# EAGLE design Zio Qwiic Gesture Sensor PAJ7620U2 (EAGLE 9.2.2)
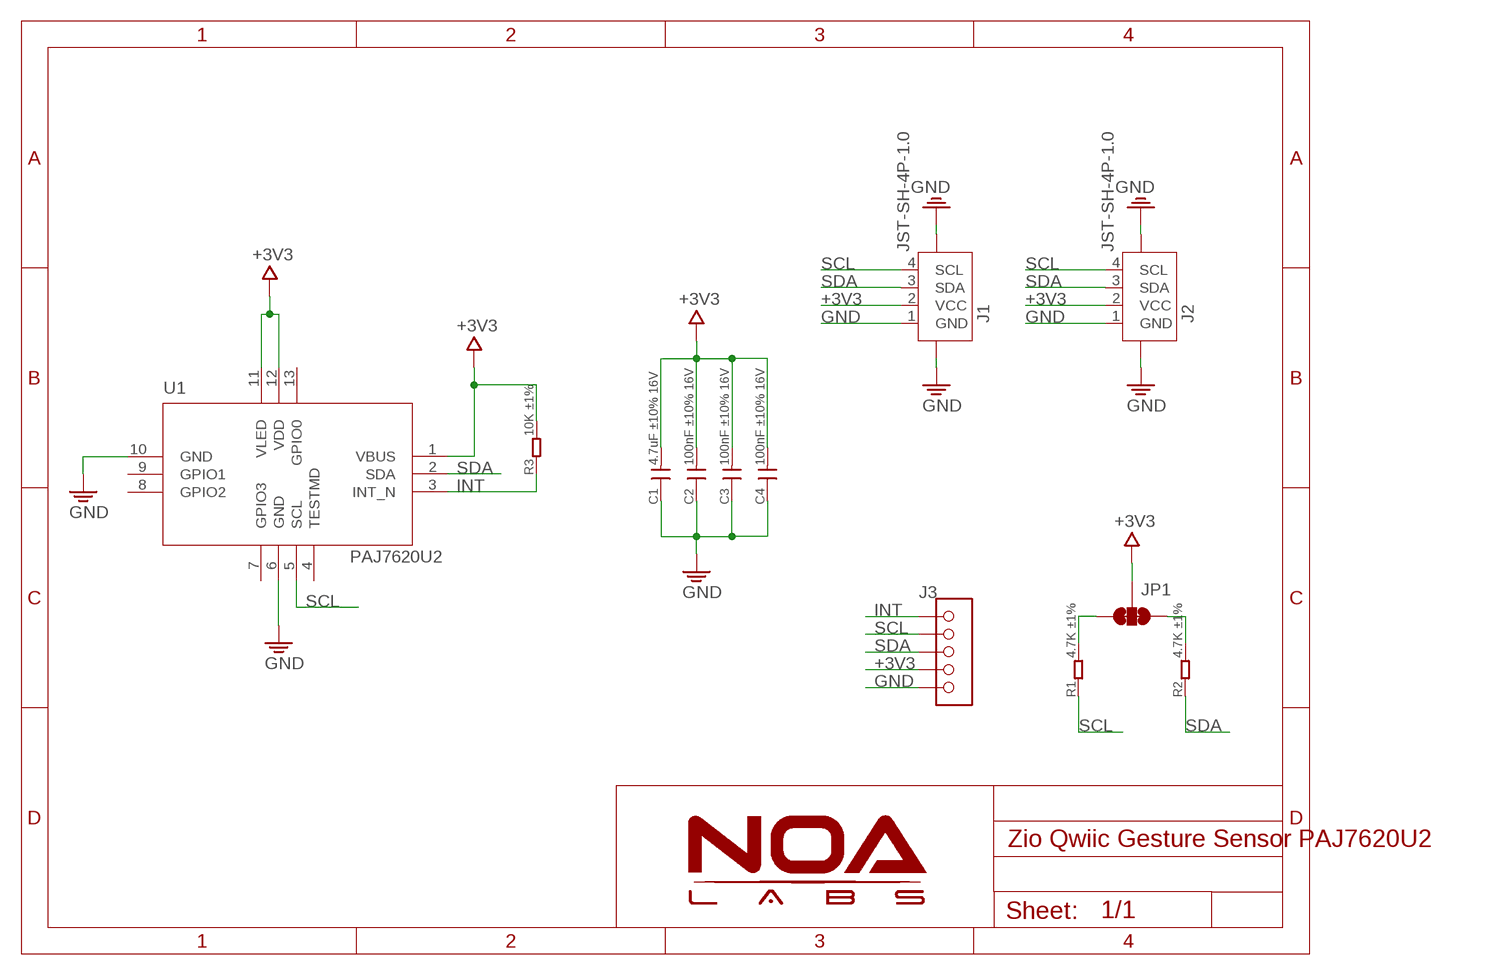
[diagram p0: schematic, sheet 1]

## Parts
C1  4.7uF ±10% 16V  C-0603  [C0603]
C2  100nF ±10% 16V  C-0603  [C0603]
C3  100nF ±10% 16V  C-0603  [C0603]
C4  100nF ±10% 16V  C-0603  [C0603]
J1  JST-SH-4P-1.0  [JST-SH-4P]
J2  JST-SH-4P-1.0  [JST-SH-4P]
J3  HEADER-5P-2.54  [5P-2.54]
JP1  SMT-JUMPER_3_2-NC_TRACE  [SMT-JUMPER_3_2-NC_TRACE]
R1  4.7K ±1%  R-0603  [R0603]
R2  4.7K ±1%  R-0603  [R0603]
R3  10K ±1%  R-0603  [R0603]
U1  PAJ7620U2  [PAJ7620U2]

## Nets
+3V3: C1.2 C2.2 C3.2 C4.2 J1.2(VCC) J2.2(VCC) J3.4 JP1.2 R3.2 U1.1(VBUS) U1.11(VLED) U1.12(VDD)
GND: C1.1 C2.1 C3.1 C4.1 J1.1(GND) J1.NC1 J1.NC2 J2.1(GND) J2.NC1 J2.NC2 J3.5 U1.6(GND) U1.10(GND)
INT: J3.1 R3.1 U1.3(INT_N)
N$6: JP1.3 R1.2
N$8: JP1.1 R2.2
SCL: J1.4(SCL) J2.4(SCL) J3.2 R1.1 U1.5(SCL)
SDA: J1.3(SDA) J2.3(SDA) J3.3 R2.1 U1.2(SDA)
Unconnected: U1.4(TESTMD) U1.7(GPIO3) U1.8(GPIO2) U1.9(GPIO1) U1.13(GPIO0)

## Library data of the parts
C1-C4 = RCL:C
J1 J2 = Connector:JST-SH-4P
J3 = Connector_NOA:HEADER-5P
JP1 = NOA-Jumpers:SMT-JUMPER_3_2-NC_TRACE
R1-R3 = RCL:R
U1 = IC:PAJ7620U2

## Board
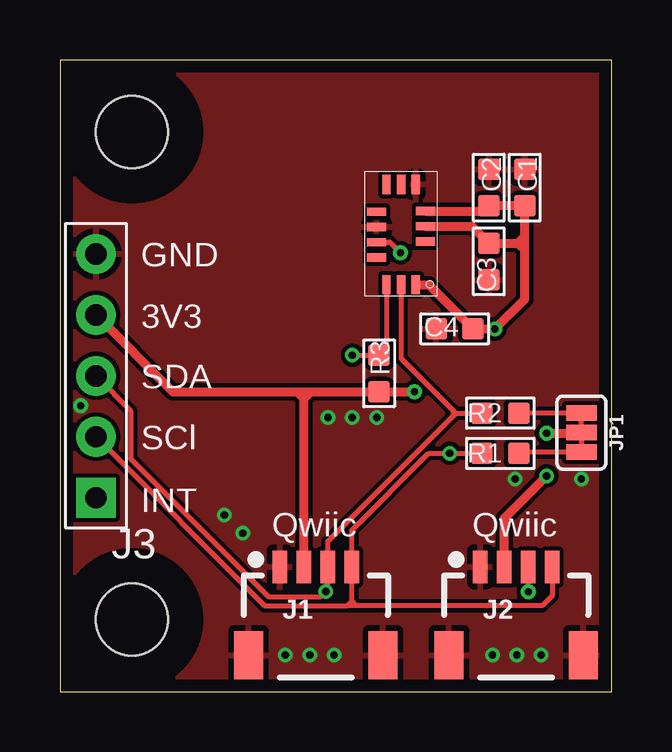
[diagram p1: board, top side]
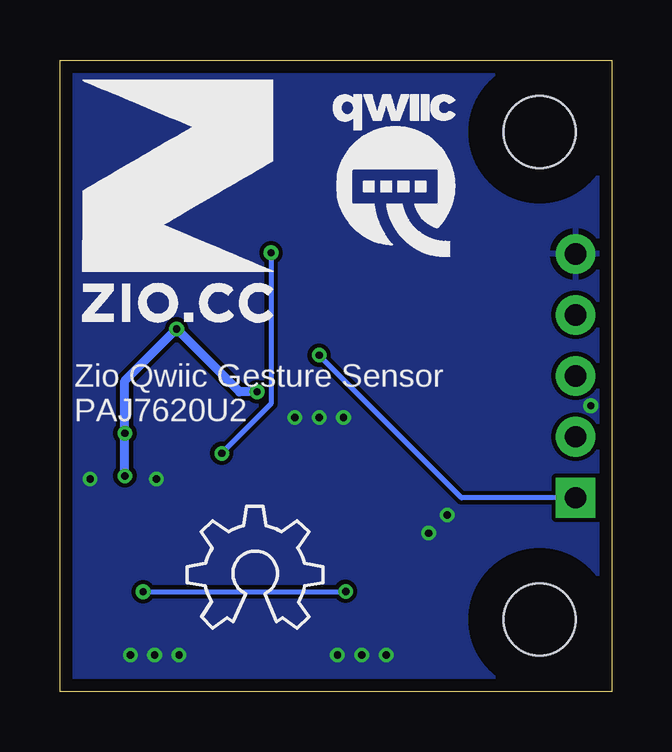
[diagram p2: board, bottom side, seen from below]

Size 23 x 26.32 mm. Coordinates in mm from the lower left corner, seen from the top.
Outline: 0,0 23,0 23,26.32 0,26.32 0,0
Copper layers (1*16): Top 0.035mm / dielectric 1.5mm / Bottom 0.035mm
Design rules "NOA Eagle Rule": minimum track width 7mil, minimum drill 12mil, track to track 7mil, track to pad 7mil, pad to pad 7mil, via to via 7mil, smd to smd 0mil, copper to edge 20mil, drill to drill 10mil, minimum pad ring 10mil, minimum via ring 6mil, stop-mask expansion 2mil, vias tented up to drill 25mil, thermal gap 10mil
Holes 3 mm at 3,3 3,23.32
tRestrict: area 0.1,0.1 to 5.9,5.9; area 0.1,20.4 to 5.9,26.2
bRestrict: area 0.1,0.1 to 5.9,5.9; area 0.1,20.4 to 5.9,26.2

### Footprints (pad centres in the part's own frame; a part is rotated, then mirrored left to right if it is on the bottom)
C0603 = smd 0.889 x 0.889: 1 -0.762,0; 2 0.762,0
JST-SH-4P = smd 0.6 x 1.35: 1 1.5,0; 2 0.5,0; 3 -0.5,0; 4 -1.5,0 | smd 1.2 x 2: NC1 -2.8,3.675; NC2 2.8,3.675
5P-2.54 = drill 0.889 pad 1.651 square: 1 0,5.08 | drill 0.889 pad 1.651: 2 0,2.54; 3 0,0; 4 0,-2.54; 5 0,-5.08
SMT-JUMPER_3_2-NC_TRACE = smd 0.635 x 1.27: 1 -0.813,0; 2 0,0; 3 0.813,0
R0603 = smd 0.889 x 0.889: 1 -0.762,0; 2 0.762,0
PAJ7620U2 = smd 0.8 x 0.35: 1 2.12,0.61; 2 2.12,0; 3 2.12,-0.61; 8 -2.06,-0.61; 9 -2.06,0; 10 -2.06,0.61 | smd 0.35 x 0.8: 4 0.983,-1.02; 5 0.348,-1.02; 6 -0.287,-1.02; 7 -0.922,-1.02; 11 -0.953,1.02; 12 -0.318,1.02; 13 0.318,1.02

### Placement (x,y rotation side)
C1  19.38,21.01 270 top
C2  17.88,21.01 270 top
C3  17.88,17.93 90 top
C4  16.46,15.11 0 top
J1  10.67,5.2 180 top
J2  19.02,5.2 180 top
J3  1.5,13.16 180 top
JP1  21.74,10.79 270 top
R1  18.36,9.93 0 top
R2  18.36,11.61 0 top
R3  13.31,13.26 270 top
U1  14.22,19.08 270 top
U$4  [10MM]  22.07,15.42 0 bottom
U$5  [QWIIC-LOGO-MEDIUM]  9.07,21.56 0 bottom
U$6  [OSHW_6X200_NOTEXT]  17.7,2.64 0 bottom

### Tracks (layer width: path | path; a pad name or v marks a point on that pad's centre or on a via)
+3V3  (via drill 0.3)
  Top 0.381: U1.11 17.67,20.03 C2.2 C1.2 19.38,18.97 | U1.12 17.18,19.39 C3.2 19.1,18.69 | U1.1 15.38,16.95 C4.2 v18.14,15.11 19.38,16.36 19.38,18.41 | 19.38,18.41 19.38,18.97 | 19.1,18.69 19.38,18.97 | 19.1,18.69 19.38,18.41 | J2.2 18.52,7.22 v20.3,8.99 | v20.3,10.77 21.72,10.77 JP1.2 | J3.4 4.7,12.5 9.88,12.5 | 9.88,12.5 10.46,12.5 | 10.46,12.5 R3.2 v14.78,12.5 | J1.2 10.17,12.2 | 10.17,12.2 10.46,12.5 | 10.17,12.2 10.17,12.21 9.88,12.5
  Bottom 0.381: v20.3,8.99 v20.3,10.77 20.3,12.95 v18.14,15.11 15.52,12.5 v14.78,12.5
GND  (via drill 0.3)
  other vias: 9.4,1.52 10.41,1.52 11.43,1.52 18.03,1.52 19.05,1.52 20.07,1.52 7.62,6.6 6.86,7.37 11.18,11.43 12.19,11.43 13.21,11.43 0.86,11.91 18.97,8.86 21.74,8.86
  pour Bottom: 0,26.31 22.99,26.31 22.99,0 0,0
  pour Top: 0,26.31 22.99,26.31 22.99,0 0,0
INT  (via drill 0.3)
  Top 0.203: U1.3 13.61,14.32 R3.1 v12.19,14.02
  Bottom 0.203: J3.1 6.25,8.08 v12.19,14.02
N$6
  Top 0.203: JP1.3 19.18,9.98 R1.2
N$8
  Top 0.203: JP1.1 R2.2
SCL  (via drill 0.3)
  Top 0.203: R1.1 v16.26,9.93 15.37,9.93 12.17,6.73 J1.4 12.17,3.76 | J3.2 8.54,3.58 11.99,3.58 | 11.99,3.58 12.17,3.76 | J2.4 20.52,3.99 20.12,3.58 12.35,3.58 | 12.35,3.58 11.99,3.58 | 12.17,3.76 12.35,3.58 | U1.5 13.76,18.73 v14.2,18.29
  Bottom 0.203: v14.2,18.29 14.2,11.99 v16.26,9.93
SDA  (via drill 0.3)
  Top 0.203: 16.5,11.61 R2.1 | 16.38,11.48 16.5,11.61 | J3.3 2.95,11.71 2.95,9.71 8.7,3.96 10.87,3.96 v11.09,4.18 11.17,4.26 J1.3 11.17,6.27 16.36,11.46 16.38,11.48 | J2.3 v19.52,4.17 v19.53,4.17 | U1.2 14.22,13.89 16.38,11.73 | 16.38,11.73 16.5,11.61 | 16.38,11.73 16.38,11.48
  Bottom 0.203: v19.53,4.17 11.1,4.17 v11.09,4.18

### Text on the board
tPlace: GND | 3V3 | SDA | SCl | INT | Qwiic | Qwiic
bPlace: Zio Qwiic Gesture Sensor / PAJ7620U2